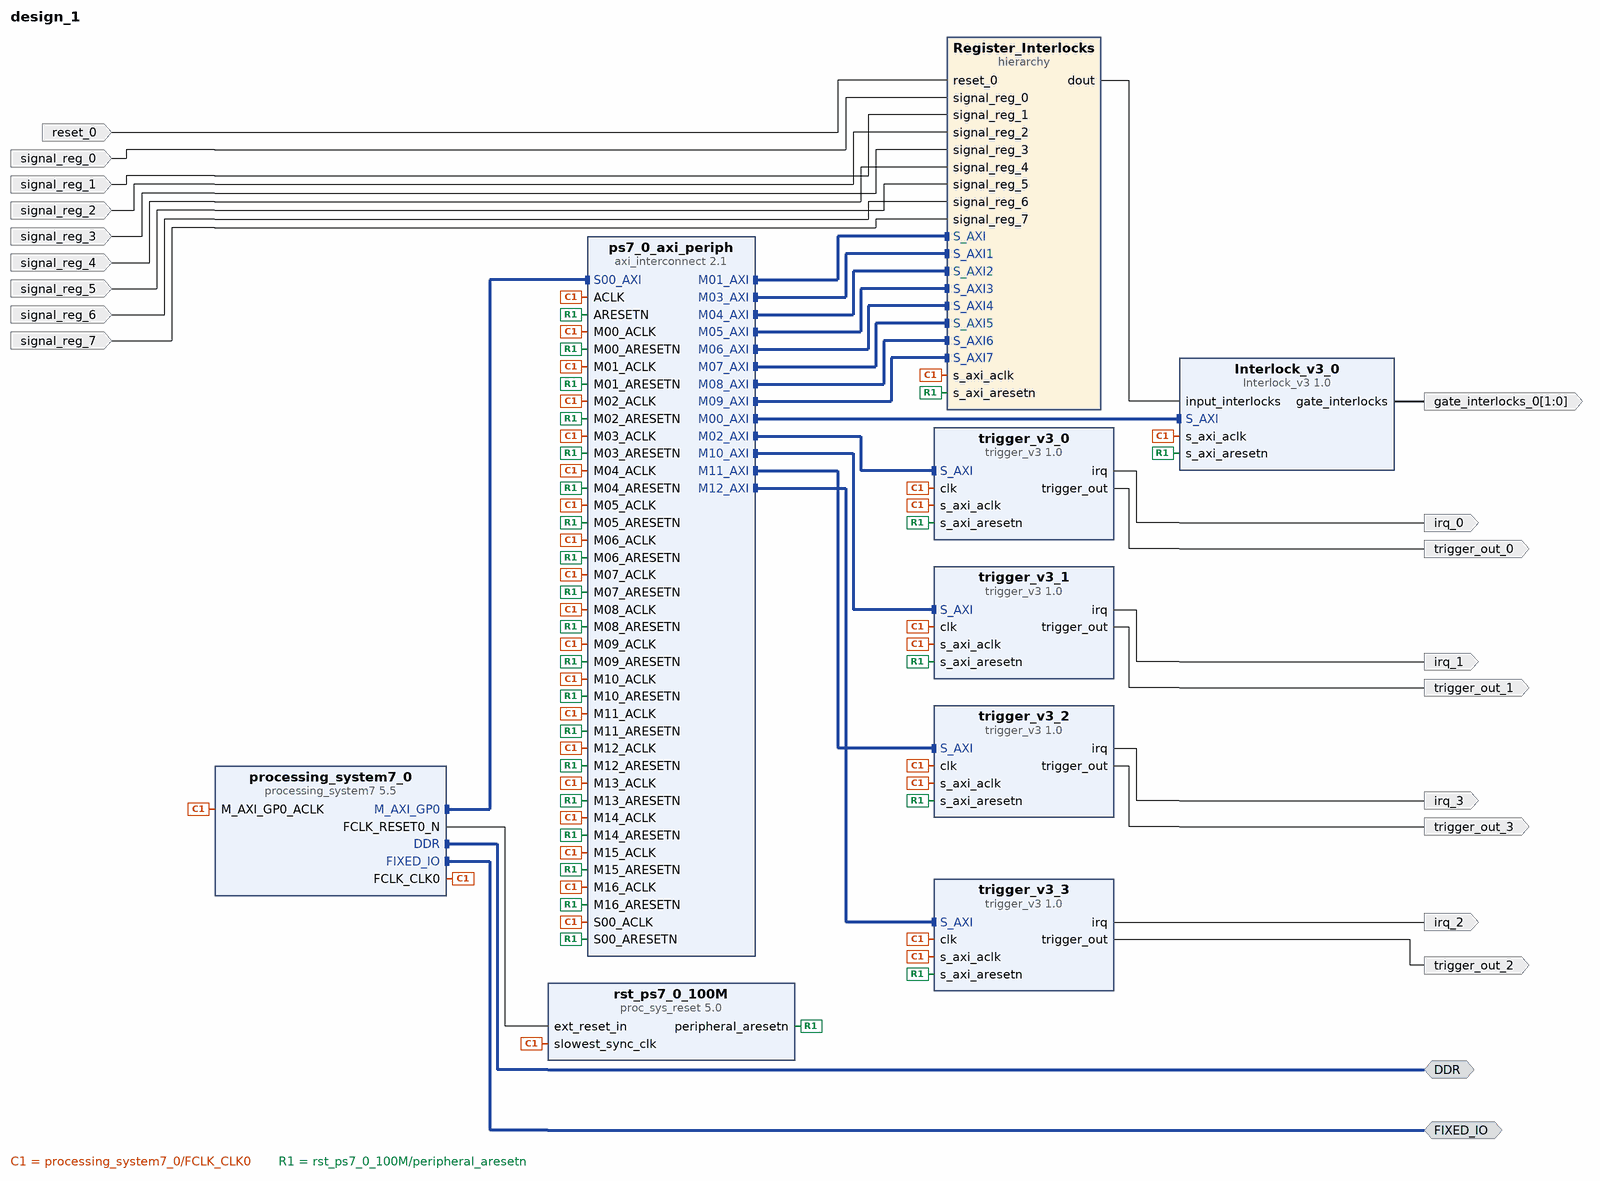
[diagram p0: block diagram of the top level]
# Vivado block design design_1, xc7z020clg400-1, Vivado 2021.2.1
create_bd_design design_1

create_bd_intf_port -mode Master -vlnv xilinx.com:interface:ddrx_rtl:1.0 DDR
create_bd_intf_port -mode Master -vlnv xilinx.com:display_processing_system7:fixedio_rtl:1.0 FIXED_IO
create_bd_port -dir O -type intr irq_0
create_bd_port -dir O -from 1 -to 0 gate_interlocks_0
create_bd_port -dir O trigger_out_0
create_bd_port -dir I -type rst reset_0
create_bd_port -dir I signal_reg_0
create_bd_port -dir I signal_reg_1
create_bd_port -dir I signal_reg_2
create_bd_port -dir I signal_reg_3
create_bd_port -dir I signal_reg_4
create_bd_port -dir I signal_reg_5
create_bd_port -dir I signal_reg_6
create_bd_port -dir I signal_reg_7
create_bd_port -dir O trigger_out_1
create_bd_port -dir O -type intr irq_1
create_bd_port -dir O -type intr irq_2
create_bd_port -dir O trigger_out_2
create_bd_port -dir O trigger_out_3
create_bd_port -dir O -type intr irq_3

create_bd_cell -type ip -vlnv xilinx.com:ip:processing_system7:5.5 processing_system7_0
set_property -dict [list \
  CONFIG.PCW_APU_PERIPHERAL_FREQMHZ 650 \
  CONFIG.PCW_CRYSTAL_PERIPHERAL_FREQMHZ 50 \
  CONFIG.PCW_ENET0_ENET0_IO {MIO 16 .. 27} \
  CONFIG.PCW_ENET0_GRP_MDIO_ENABLE 1 \
  CONFIG.PCW_ENET0_GRP_MDIO_IO {MIO 52 .. 53} \
  CONFIG.PCW_ENET0_PERIPHERAL_ENABLE 1 \
  CONFIG.PCW_ENET0_RESET_ENABLE 1 \
  CONFIG.PCW_ENET0_RESET_IO {MIO 9} \
  CONFIG.PCW_ENET_RESET_ENABLE 1 \
  CONFIG.PCW_ENET_RESET_SELECT {Share reset pin} \
  CONFIG.PCW_FPGA0_PERIPHERAL_FREQMHZ 100 \
  CONFIG.PCW_FPGA1_PERIPHERAL_FREQMHZ 50 \
  CONFIG.PCW_GPIO_MIO_GPIO_ENABLE 1 \
  CONFIG.PCW_GPIO_MIO_GPIO_IO MIO \
  CONFIG.PCW_I2C_RESET_ENABLE 1 \
  CONFIG.PCW_M_AXI_GP0_FREQMHZ 10 \
  CONFIG.PCW_PERIPHERAL_BOARD_PRESET part0 \
  CONFIG.PCW_PRESET_BANK1_VOLTAGE {LVCMOS 1.8V} \
  CONFIG.PCW_QSPI_GRP_FBCLK_ENABLE 1 \
  CONFIG.PCW_QSPI_GRP_FBCLK_IO {MIO 8} \
  CONFIG.PCW_QSPI_GRP_SINGLE_SS_ENABLE 1 \
  CONFIG.PCW_QSPI_GRP_SINGLE_SS_IO {MIO 1 .. 6} \
  CONFIG.PCW_QSPI_PERIPHERAL_ENABLE 1 \
  CONFIG.PCW_QSPI_QSPI_IO {MIO 1 .. 6} \
  CONFIG.PCW_SD0_GRP_CD_ENABLE 1 \
  CONFIG.PCW_SD0_GRP_CD_IO {MIO 47} \
  CONFIG.PCW_SD0_GRP_WP_ENABLE 0 \
  CONFIG.PCW_SD0_PERIPHERAL_ENABLE 1 \
  CONFIG.PCW_SD0_SD0_IO {MIO 40 .. 45} \
  CONFIG.PCW_SDIO_PERIPHERAL_FREQMHZ 50 \
  CONFIG.PCW_SINGLE_QSPI_DATA_MODE x4 \
  CONFIG.PCW_UART0_PERIPHERAL_ENABLE 1 \
  CONFIG.PCW_UART0_UART0_IO {MIO 14 .. 15} \
  CONFIG.PCW_UART1_PERIPHERAL_ENABLE 0 \
  CONFIG.PCW_UART_PERIPHERAL_FREQMHZ 100 \
  CONFIG.PCW_UIPARAM_DDR_BUS_WIDTH {16 Bit} \
  CONFIG.PCW_UIPARAM_DDR_FREQ_MHZ 525 \
  CONFIG.PCW_UIPARAM_DDR_PARTNO {MT41J256M16 RE-125} \
  CONFIG.PCW_USB0_PERIPHERAL_ENABLE 1 \
  CONFIG.PCW_USB0_RESET_ENABLE 1 \
  CONFIG.PCW_USB0_RESET_IO {MIO 46} \
  CONFIG.PCW_USB0_USB0_IO {MIO 28 .. 39} \
  CONFIG.PCW_USB_RESET_ENABLE 1 \
  CONFIG.PCW_USB_RESET_SELECT {Share reset pin} \
] [get_bd_cells processing_system7_0]
# 486 more settings of processing_system7_0 are not shown: defaults, MIO pin electricals, DDR timing, and values the tool derives
create_bd_cell -type ip -vlnv xilinx.com:ip:axi_interconnect:2.1 ps7_0_axi_periph
set_property -dict {CONFIG.NUM_MI 17} [get_bd_cells ps7_0_axi_periph]
create_bd_cell -type ip -vlnv xilinx.com:ip:proc_sys_reset:5.0 rst_ps7_0_100M
create_bd_cell -type ip -vlnv user.org:user:Interlock_v3:1.0 Interlock_v3_0
set_property -dict {CONFIG.EXT_INTERLOCKS 16 CONFIG.GATE_INTERLOCKS 2} [get_bd_cells Interlock_v3_0]
create_bd_cell -type ip -vlnv user.org:user:trigger_v3:1.0 trigger_v3_0
create_bd_cell -type hier Register_Interlocks
create_bd_cell -type ip -vlnv user.org:user:trigger_v3:1.0 trigger_v3_1
create_bd_cell -type ip -vlnv user.org:user:trigger_v3:1.0 trigger_v3_2
create_bd_cell -type ip -vlnv user.org:user:trigger_v3:1.0 trigger_v3_3

# ---- hierarchy /Register_Interlocks ----
current_bd_instance /Register_Interlocks
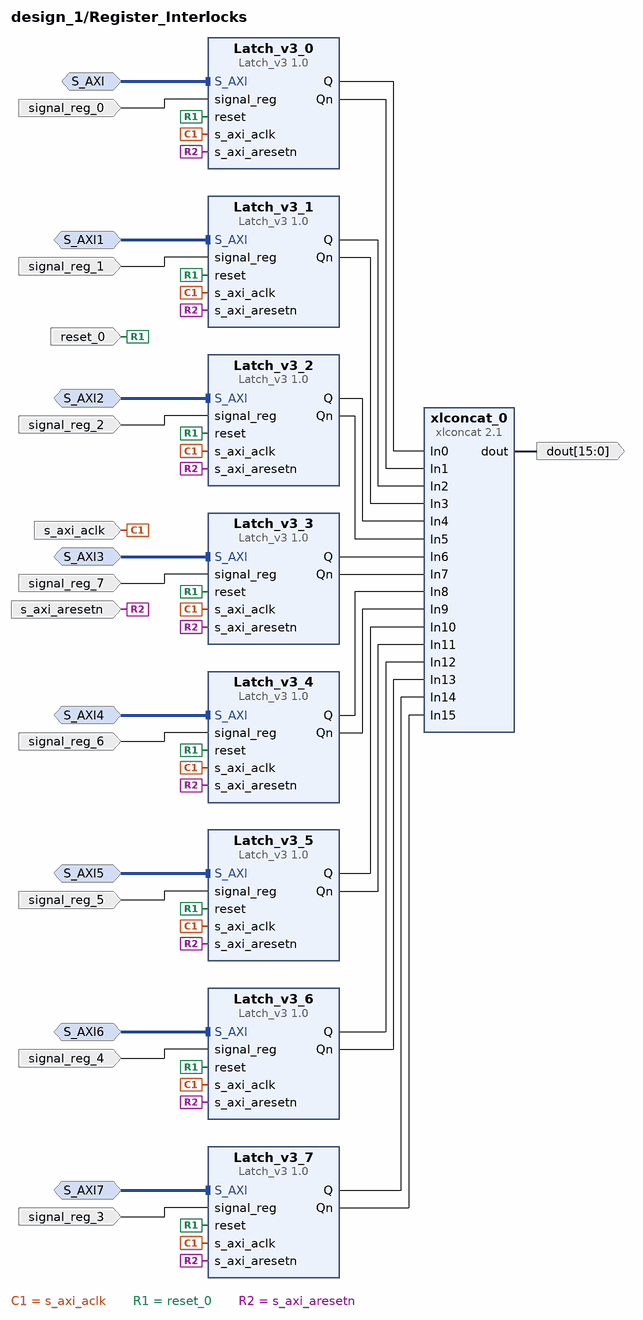
[diagram p1: block diagram inside /Register_Interlocks]
create_bd_intf_pin -mode Slave -vlnv xilinx.com:interface:aximm_rtl:1.0 S_AXI
create_bd_intf_pin -mode Slave -vlnv xilinx.com:interface:aximm_rtl:1.0 S_AXI1
create_bd_intf_pin -mode Slave -vlnv xilinx.com:interface:aximm_rtl:1.0 S_AXI2
create_bd_intf_pin -mode Slave -vlnv xilinx.com:interface:aximm_rtl:1.0 S_AXI3
create_bd_intf_pin -mode Slave -vlnv xilinx.com:interface:aximm_rtl:1.0 S_AXI4
create_bd_intf_pin -mode Slave -vlnv xilinx.com:interface:aximm_rtl:1.0 S_AXI5
create_bd_intf_pin -mode Slave -vlnv xilinx.com:interface:aximm_rtl:1.0 S_AXI6
create_bd_intf_pin -mode Slave -vlnv xilinx.com:interface:aximm_rtl:1.0 S_AXI7
create_bd_pin -dir I signal_reg_0
create_bd_pin -dir I -type rst reset_0
create_bd_pin -dir I -type clk s_axi_aclk
create_bd_pin -dir I -type rst s_axi_aresetn
create_bd_pin -dir I signal_reg_1
create_bd_pin -dir I signal_reg_2
create_bd_pin -dir I signal_reg_7
create_bd_pin -dir I signal_reg_6
create_bd_pin -dir I signal_reg_5
create_bd_pin -dir I signal_reg_4
create_bd_pin -dir I signal_reg_3
create_bd_pin -dir O -from 15 -to 0 dout

create_bd_cell -type ip -vlnv user.org:user:Latch_v3:1.0 Latch_v3_0
create_bd_cell -type ip -vlnv user.org:user:Latch_v3:1.0 Latch_v3_1
create_bd_cell -type ip -vlnv user.org:user:Latch_v3:1.0 Latch_v3_2
create_bd_cell -type ip -vlnv user.org:user:Latch_v3:1.0 Latch_v3_3
create_bd_cell -type ip -vlnv user.org:user:Latch_v3:1.0 Latch_v3_4
create_bd_cell -type ip -vlnv user.org:user:Latch_v3:1.0 Latch_v3_5
create_bd_cell -type ip -vlnv user.org:user:Latch_v3:1.0 Latch_v3_6
create_bd_cell -type ip -vlnv user.org:user:Latch_v3:1.0 Latch_v3_7
create_bd_cell -type ip -vlnv xilinx.com:ip:xlconcat:2.1 xlconcat_0
set_property -dict {CONFIG.NUM_PORTS 16} [get_bd_cells xlconcat_0]

# ---- connections ----

current_bd_instance /Register_Interlocks
connect_bd_intf_net [get_bd_intf_pins S_AXI] [get_bd_intf_pins Latch_v3_0/S_AXI]
connect_bd_intf_net [get_bd_intf_pins S_AXI1] [get_bd_intf_pins Latch_v3_1/S_AXI]
connect_bd_intf_net [get_bd_intf_pins S_AXI2] [get_bd_intf_pins Latch_v3_2/S_AXI]
connect_bd_intf_net [get_bd_intf_pins S_AXI3] [get_bd_intf_pins Latch_v3_3/S_AXI]
connect_bd_intf_net [get_bd_intf_pins S_AXI4] [get_bd_intf_pins Latch_v3_4/S_AXI]
connect_bd_intf_net [get_bd_intf_pins S_AXI5] [get_bd_intf_pins Latch_v3_5/S_AXI]
connect_bd_intf_net [get_bd_intf_pins S_AXI6] [get_bd_intf_pins Latch_v3_6/S_AXI]
connect_bd_intf_net [get_bd_intf_pins S_AXI7] [get_bd_intf_pins Latch_v3_7/S_AXI]
connect_bd_net [get_bd_pins Latch_v3_0/Q] [get_bd_pins xlconcat_0/In0]
connect_bd_net [get_bd_pins Latch_v3_0/Qn] [get_bd_pins xlconcat_0/In1]
connect_bd_net [get_bd_pins Latch_v3_1/Q] [get_bd_pins xlconcat_0/In2]
connect_bd_net [get_bd_pins Latch_v3_1/Qn] [get_bd_pins xlconcat_0/In3]
connect_bd_net [get_bd_pins Latch_v3_2/Q] [get_bd_pins xlconcat_0/In4]
connect_bd_net [get_bd_pins Latch_v3_2/Qn] [get_bd_pins xlconcat_0/In5]
connect_bd_net [get_bd_pins Latch_v3_3/Q] [get_bd_pins xlconcat_0/In6]
connect_bd_net [get_bd_pins Latch_v3_3/Qn] [get_bd_pins xlconcat_0/In7]
connect_bd_net [get_bd_pins Latch_v3_4/Q] [get_bd_pins xlconcat_0/In8]
connect_bd_net [get_bd_pins Latch_v3_4/Qn] [get_bd_pins xlconcat_0/In9]
connect_bd_net [get_bd_pins Latch_v3_5/Q] [get_bd_pins xlconcat_0/In10]
connect_bd_net [get_bd_pins Latch_v3_5/Qn] [get_bd_pins xlconcat_0/In11]
connect_bd_net [get_bd_pins Latch_v3_6/Q] [get_bd_pins xlconcat_0/In12]
connect_bd_net [get_bd_pins Latch_v3_6/Qn] [get_bd_pins xlconcat_0/In13]
connect_bd_net [get_bd_pins Latch_v3_7/Q] [get_bd_pins xlconcat_0/In14]
connect_bd_net [get_bd_pins Latch_v3_7/Qn] [get_bd_pins xlconcat_0/In15]
connect_bd_net -net processing_system7_0_FCLK_CLK0 [get_bd_pins s_axi_aclk] \
  [get_bd_pins Latch_v3_1/s_axi_aclk] [get_bd_pins Latch_v3_2/s_axi_aclk] [get_bd_pins Latch_v3_3/s_axi_aclk] \
  [get_bd_pins Latch_v3_4/s_axi_aclk] [get_bd_pins Latch_v3_5/s_axi_aclk] [get_bd_pins Latch_v3_6/s_axi_aclk] \
  [get_bd_pins Latch_v3_7/s_axi_aclk] [get_bd_pins Latch_v3_0/s_axi_aclk]
connect_bd_net -net reset_0_1 [get_bd_pins reset_0] \
  [get_bd_pins Latch_v3_1/reset] [get_bd_pins Latch_v3_2/reset] [get_bd_pins Latch_v3_3/reset] [get_bd_pins Latch_v3_4/reset] \
  [get_bd_pins Latch_v3_5/reset] [get_bd_pins Latch_v3_6/reset] [get_bd_pins Latch_v3_7/reset] [get_bd_pins Latch_v3_0/reset]
connect_bd_net -net rst_ps7_0_100M_peripheral_aresetn [get_bd_pins s_axi_aresetn] \
  [get_bd_pins Latch_v3_1/s_axi_aresetn] [get_bd_pins Latch_v3_2/s_axi_aresetn] [get_bd_pins Latch_v3_3/s_axi_aresetn] \
  [get_bd_pins Latch_v3_4/s_axi_aresetn] [get_bd_pins Latch_v3_5/s_axi_aresetn] [get_bd_pins Latch_v3_6/s_axi_aresetn] \
  [get_bd_pins Latch_v3_7/s_axi_aresetn] [get_bd_pins Latch_v3_0/s_axi_aresetn]
connect_bd_net -net signal_reg_0_1 [get_bd_pins signal_reg_0] [get_bd_pins Latch_v3_0/signal_reg]
connect_bd_net -net signal_reg_1_1 [get_bd_pins signal_reg_1] [get_bd_pins Latch_v3_1/signal_reg]
connect_bd_net -net signal_reg_2_1 [get_bd_pins signal_reg_2] [get_bd_pins Latch_v3_2/signal_reg]
connect_bd_net -net signal_reg_3_1 [get_bd_pins signal_reg_3] [get_bd_pins Latch_v3_7/signal_reg]
connect_bd_net -net signal_reg_4_1 [get_bd_pins signal_reg_4] [get_bd_pins Latch_v3_6/signal_reg]
connect_bd_net -net signal_reg_5_1 [get_bd_pins signal_reg_5] [get_bd_pins Latch_v3_5/signal_reg]
connect_bd_net -net signal_reg_6_1 [get_bd_pins signal_reg_6] [get_bd_pins Latch_v3_4/signal_reg]
connect_bd_net -net signal_reg_7_1 [get_bd_pins signal_reg_7] [get_bd_pins Latch_v3_3/signal_reg]
connect_bd_net [get_bd_pins xlconcat_0/dout] [get_bd_pins dout]

current_bd_instance /
connect_bd_intf_net [get_bd_intf_ports DDR] [get_bd_intf_pins processing_system7_0/DDR]
connect_bd_intf_net [get_bd_intf_ports FIXED_IO] [get_bd_intf_pins processing_system7_0/FIXED_IO]
connect_bd_intf_net [get_bd_intf_pins processing_system7_0/M_AXI_GP0] [get_bd_intf_pins ps7_0_axi_periph/S00_AXI]
connect_bd_intf_net [get_bd_intf_pins ps7_0_axi_periph/M00_AXI] [get_bd_intf_pins Interlock_v3_0/S_AXI]
connect_bd_intf_net [get_bd_intf_pins ps7_0_axi_periph/M01_AXI] [get_bd_intf_pins Register_Interlocks/S_AXI]
connect_bd_intf_net [get_bd_intf_pins ps7_0_axi_periph/M02_AXI] [get_bd_intf_pins trigger_v3_0/S_AXI]
connect_bd_intf_net [get_bd_intf_pins ps7_0_axi_periph/M03_AXI] [get_bd_intf_pins Register_Interlocks/S_AXI1]
connect_bd_intf_net [get_bd_intf_pins ps7_0_axi_periph/M04_AXI] [get_bd_intf_pins Register_Interlocks/S_AXI2]
connect_bd_intf_net [get_bd_intf_pins ps7_0_axi_periph/M05_AXI] [get_bd_intf_pins Register_Interlocks/S_AXI3]
connect_bd_intf_net [get_bd_intf_pins ps7_0_axi_periph/M06_AXI] [get_bd_intf_pins Register_Interlocks/S_AXI4]
connect_bd_intf_net [get_bd_intf_pins ps7_0_axi_periph/M07_AXI] [get_bd_intf_pins Register_Interlocks/S_AXI5]
connect_bd_intf_net [get_bd_intf_pins ps7_0_axi_periph/M08_AXI] [get_bd_intf_pins Register_Interlocks/S_AXI6]
connect_bd_intf_net [get_bd_intf_pins ps7_0_axi_periph/M09_AXI] [get_bd_intf_pins Register_Interlocks/S_AXI7]
connect_bd_intf_net [get_bd_intf_pins ps7_0_axi_periph/M10_AXI] [get_bd_intf_pins trigger_v3_1/S_AXI]
connect_bd_intf_net [get_bd_intf_pins ps7_0_axi_periph/M11_AXI] [get_bd_intf_pins trigger_v3_2/S_AXI]
connect_bd_intf_net [get_bd_intf_pins ps7_0_axi_periph/M12_AXI] [get_bd_intf_pins trigger_v3_3/S_AXI]
connect_bd_net [get_bd_pins Interlock_v3_0/gate_interlocks] [get_bd_ports gate_interlocks_0]
connect_bd_net [get_bd_pins processing_system7_0/FCLK_CLK0] \
  [get_bd_pins processing_system7_0/M_AXI_GP0_ACLK] [get_bd_pins ps7_0_axi_periph/S00_ACLK] \
  [get_bd_pins rst_ps7_0_100M/slowest_sync_clk] [get_bd_pins ps7_0_axi_periph/M00_ACLK] [get_bd_pins ps7_0_axi_periph/ACLK] \
  [get_bd_pins ps7_0_axi_periph/M01_ACLK] [get_bd_pins ps7_0_axi_periph/M02_ACLK] [get_bd_pins Interlock_v3_0/s_axi_aclk] \
  [get_bd_pins trigger_v3_0/clk] [get_bd_pins trigger_v3_0/s_axi_aclk] [get_bd_pins ps7_0_axi_periph/M03_ACLK] \
  [get_bd_pins ps7_0_axi_periph/M04_ACLK] [get_bd_pins ps7_0_axi_periph/M05_ACLK] [get_bd_pins ps7_0_axi_periph/M06_ACLK] \
  [get_bd_pins ps7_0_axi_periph/M07_ACLK] [get_bd_pins ps7_0_axi_periph/M08_ACLK] [get_bd_pins ps7_0_axi_periph/M09_ACLK] \
  [get_bd_pins ps7_0_axi_periph/M10_ACLK] [get_bd_pins ps7_0_axi_periph/M11_ACLK] [get_bd_pins ps7_0_axi_periph/M12_ACLK] \
  [get_bd_pins ps7_0_axi_periph/M13_ACLK] [get_bd_pins ps7_0_axi_periph/M14_ACLK] [get_bd_pins ps7_0_axi_periph/M15_ACLK] \
  [get_bd_pins ps7_0_axi_periph/M16_ACLK] [get_bd_pins Register_Interlocks/s_axi_aclk] [get_bd_pins trigger_v3_1/clk] \
  [get_bd_pins trigger_v3_1/s_axi_aclk] [get_bd_pins trigger_v3_2/clk] [get_bd_pins trigger_v3_3/clk] \
  [get_bd_pins trigger_v3_3/s_axi_aclk] [get_bd_pins trigger_v3_2/s_axi_aclk]
connect_bd_net [get_bd_pins processing_system7_0/FCLK_RESET0_N] [get_bd_pins rst_ps7_0_100M/ext_reset_in]
connect_bd_net -net reset_0_1 [get_bd_ports reset_0] [get_bd_pins Register_Interlocks/reset_0]
connect_bd_net [get_bd_pins rst_ps7_0_100M/peripheral_aresetn] \
  [get_bd_pins ps7_0_axi_periph/S00_ARESETN] [get_bd_pins ps7_0_axi_periph/M00_ARESETN] \
  [get_bd_pins ps7_0_axi_periph/ARESETN] [get_bd_pins ps7_0_axi_periph/M01_ARESETN] \
  [get_bd_pins ps7_0_axi_periph/M02_ARESETN] [get_bd_pins Interlock_v3_0/s_axi_aresetn] \
  [get_bd_pins trigger_v3_0/s_axi_aresetn] [get_bd_pins ps7_0_axi_periph/M03_ARESETN] \
  [get_bd_pins ps7_0_axi_periph/M04_ARESETN] [get_bd_pins ps7_0_axi_periph/M05_ARESETN] \
  [get_bd_pins ps7_0_axi_periph/M06_ARESETN] [get_bd_pins ps7_0_axi_periph/M07_ARESETN] \
  [get_bd_pins ps7_0_axi_periph/M08_ARESETN] [get_bd_pins ps7_0_axi_periph/M09_ARESETN] \
  [get_bd_pins ps7_0_axi_periph/M10_ARESETN] [get_bd_pins ps7_0_axi_periph/M11_ARESETN] \
  [get_bd_pins ps7_0_axi_periph/M12_ARESETN] [get_bd_pins ps7_0_axi_periph/M13_ARESETN] \
  [get_bd_pins ps7_0_axi_periph/M14_ARESETN] [get_bd_pins ps7_0_axi_periph/M15_ARESETN] \
  [get_bd_pins ps7_0_axi_periph/M16_ARESETN] [get_bd_pins Register_Interlocks/s_axi_aresetn] \
  [get_bd_pins trigger_v3_1/s_axi_aresetn] [get_bd_pins trigger_v3_3/s_axi_aresetn] [get_bd_pins trigger_v3_2/s_axi_aresetn]
connect_bd_net -net signal_reg_0_1 [get_bd_ports signal_reg_0] [get_bd_pins Register_Interlocks/signal_reg_0]
connect_bd_net -net signal_reg_1_1 [get_bd_ports signal_reg_1] [get_bd_pins Register_Interlocks/signal_reg_1]
connect_bd_net -net signal_reg_2_1 [get_bd_ports signal_reg_2] [get_bd_pins Register_Interlocks/signal_reg_2]
connect_bd_net -net signal_reg_3_1 [get_bd_ports signal_reg_3] [get_bd_pins Register_Interlocks/signal_reg_3]
connect_bd_net -net signal_reg_4_1 [get_bd_ports signal_reg_4] [get_bd_pins Register_Interlocks/signal_reg_4]
connect_bd_net -net signal_reg_5_1 [get_bd_ports signal_reg_5] [get_bd_pins Register_Interlocks/signal_reg_5]
connect_bd_net -net signal_reg_6_1 [get_bd_ports signal_reg_6] [get_bd_pins Register_Interlocks/signal_reg_6]
connect_bd_net -net signal_reg_7_1 [get_bd_ports signal_reg_7] [get_bd_pins Register_Interlocks/signal_reg_7]
connect_bd_net [get_bd_pins trigger_v3_0/irq] [get_bd_ports irq_0]
connect_bd_net [get_bd_pins trigger_v3_0/trigger_out] [get_bd_ports trigger_out_0]
connect_bd_net [get_bd_pins trigger_v3_1/irq] [get_bd_ports irq_1]
connect_bd_net [get_bd_pins trigger_v3_1/trigger_out] [get_bd_ports trigger_out_1]
connect_bd_net [get_bd_pins trigger_v3_2/irq] [get_bd_ports irq_3]
connect_bd_net [get_bd_pins trigger_v3_2/trigger_out] [get_bd_ports trigger_out_3]
connect_bd_net [get_bd_pins trigger_v3_3/irq] [get_bd_ports irq_2]
connect_bd_net [get_bd_pins trigger_v3_3/trigger_out] [get_bd_ports trigger_out_2]
connect_bd_net -net xlconcat_0_dout [get_bd_pins Register_Interlocks/dout] [get_bd_pins Interlock_v3_0/input_interlocks]

# ---- address map ----
assign_bd_address -offset 0x43C00000 -range 64K -target_address_space [get_bd_addr_spaces processing_system7_0/Data] [get_bd_addr_segs Interlock_v3_0/S_AXI/S_AXI_reg]
assign_bd_address -offset 0x43C10000 -range 64K -target_address_space [get_bd_addr_spaces processing_system7_0/Data] [get_bd_addr_segs Register_Interlocks/Latch_v3_0/S_AXI/S_AXI_reg]
assign_bd_address -offset 0x43C20000 -range 64K -target_address_space [get_bd_addr_spaces processing_system7_0/Data] [get_bd_addr_segs trigger_v3_0/S_AXI/S_AXI_reg]
assign_bd_address -offset 0x43C30000 -range 64K -target_address_space [get_bd_addr_spaces processing_system7_0/Data] [get_bd_addr_segs Register_Interlocks/Latch_v3_1/S_AXI/S_AXI_reg]
assign_bd_address -offset 0x43C40000 -range 64K -target_address_space [get_bd_addr_spaces processing_system7_0/Data] [get_bd_addr_segs Register_Interlocks/Latch_v3_2/S_AXI/S_AXI_reg]
assign_bd_address -offset 0x43C50000 -range 64K -target_address_space [get_bd_addr_spaces processing_system7_0/Data] [get_bd_addr_segs Register_Interlocks/Latch_v3_3/S_AXI/S_AXI_reg]
assign_bd_address -offset 0x43C60000 -range 64K -target_address_space [get_bd_addr_spaces processing_system7_0/Data] [get_bd_addr_segs Register_Interlocks/Latch_v3_4/S_AXI/S_AXI_reg]
assign_bd_address -offset 0x43C70000 -range 64K -target_address_space [get_bd_addr_spaces processing_system7_0/Data] [get_bd_addr_segs Register_Interlocks/Latch_v3_5/S_AXI/S_AXI_reg]
assign_bd_address -offset 0x43C80000 -range 64K -target_address_space [get_bd_addr_spaces processing_system7_0/Data] [get_bd_addr_segs Register_Interlocks/Latch_v3_6/S_AXI/S_AXI_reg]
assign_bd_address -offset 0x43C90000 -range 64K -target_address_space [get_bd_addr_spaces processing_system7_0/Data] [get_bd_addr_segs Register_Interlocks/Latch_v3_7/S_AXI/S_AXI_reg]
assign_bd_address -offset 0x43CA0000 -range 64K -target_address_space [get_bd_addr_spaces processing_system7_0/Data] [get_bd_addr_segs trigger_v3_1/S_AXI/S_AXI_reg]
assign_bd_address -offset 0x43CB0000 -range 64K -target_address_space [get_bd_addr_spaces processing_system7_0/Data] [get_bd_addr_segs trigger_v3_2/S_AXI/S_AXI_reg]
assign_bd_address -offset 0x43CC0000 -range 64K -target_address_space [get_bd_addr_spaces processing_system7_0/Data] [get_bd_addr_segs trigger_v3_3/S_AXI/S_AXI_reg]

validate_bd_design
save_bd_design
